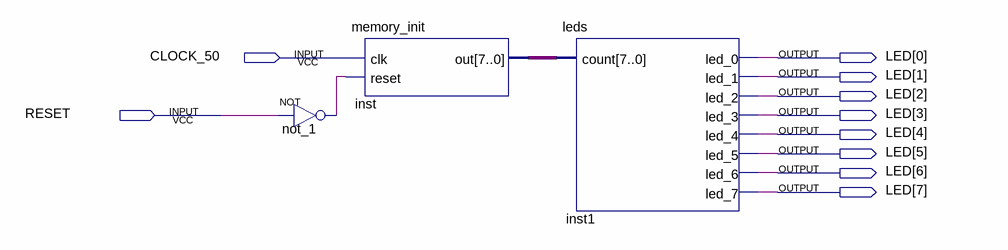
[diagram p0: schematic sheet]
// Quartus schematic memory.bdf as structural Verilog: 3 symbols, 10 pins
module memory (
  input  CLOCK_50,
  input  RESET,
  output [7:0] LED
);

  wire not_1_out;
  wire [7:0] inst_out;

  not not_1 (not_1_out, RESET);
  memory_init inst (.clk(CLOCK_50), .reset(not_1_out), .out(inst_out));
  leds inst1 (
    .count(inst_out), .led_0(LED[0]), .led_1(LED[1]), .led_2(LED[2]), .led_3(LED[3]), .led_4(LED[4]),
    .led_5(LED[5]), .led_6(LED[6]), .led_7(LED[7]));
endmodule
